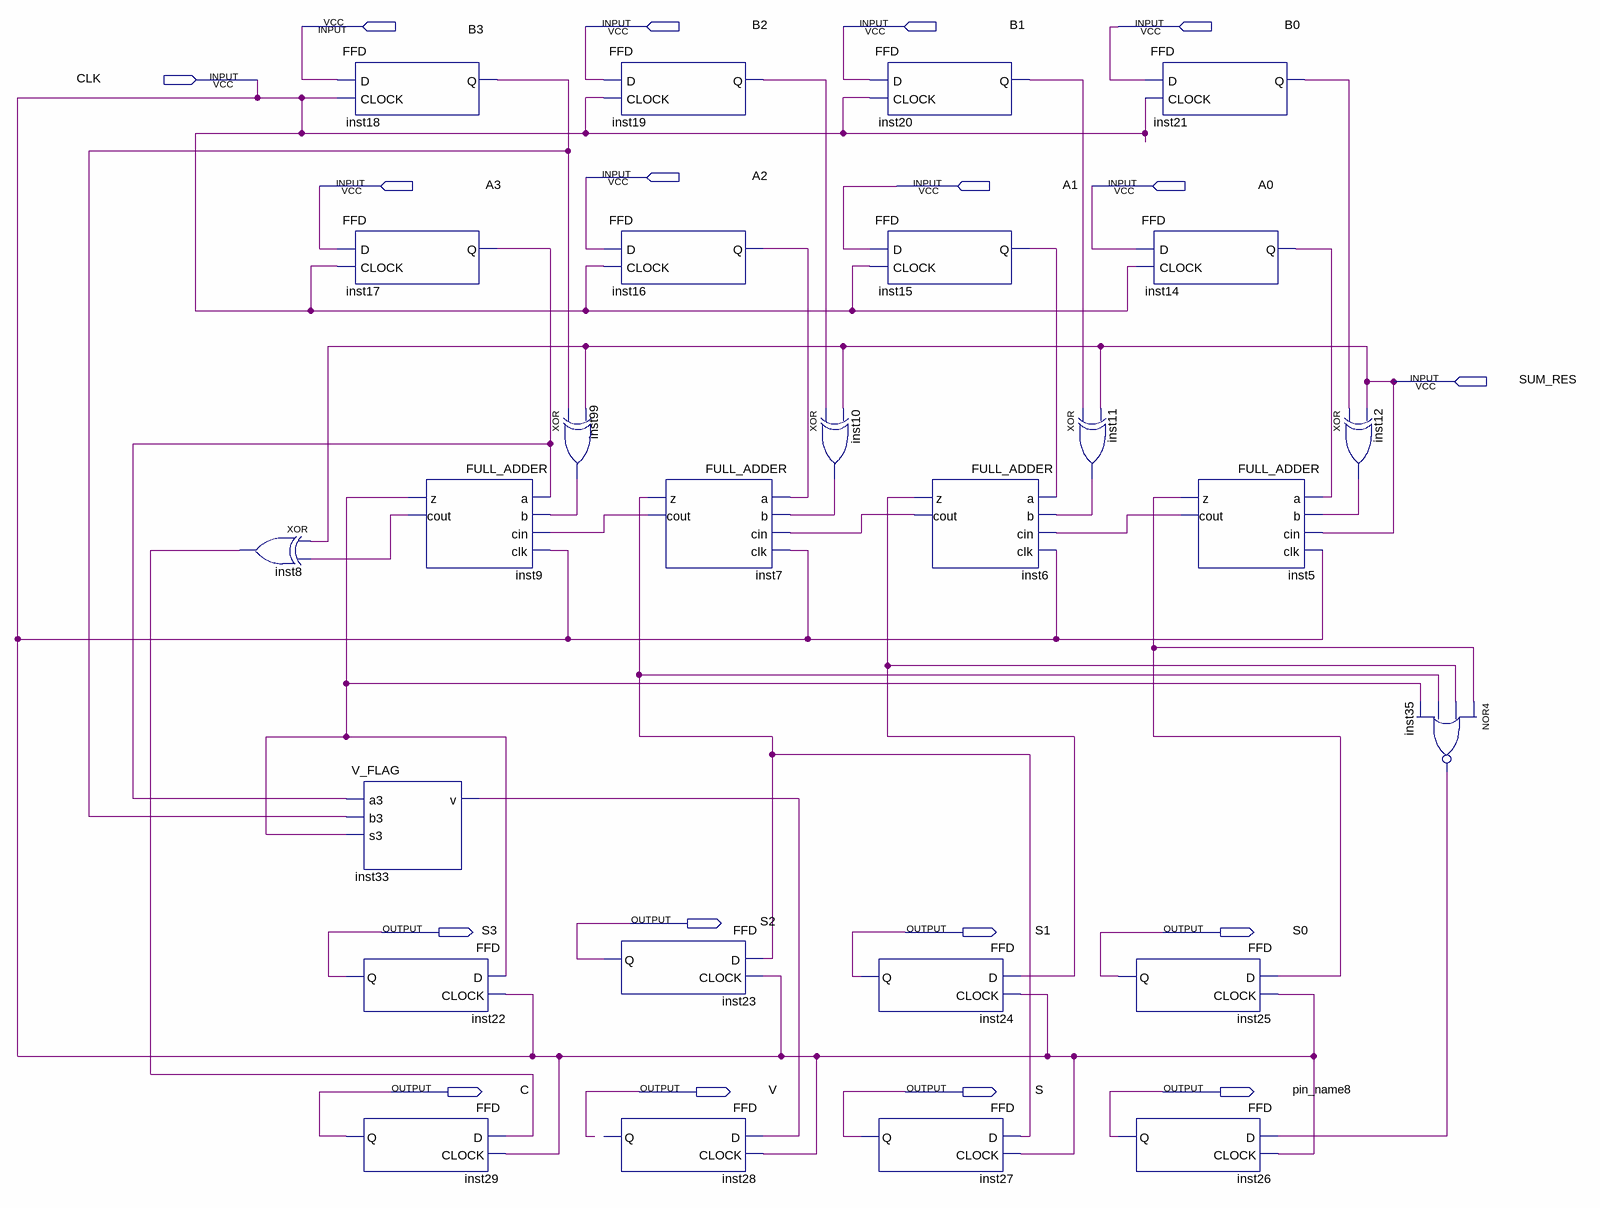
[diagram p0: schematic sheet]
// Quartus schematic PARTE_C.bdf as structural Verilog: 27 symbols, 18 pins
module PARTE_C (
  input  B3,
  input  B2,
  input  B1,
  input  B0,
  input  CLK,
  input  A2,
  input  A3,
  input  A1,
  input  A0,
  input  SUM_RES,
  output S2,
  output S3,
  output S1,
  output S0,
  output C,
  output V,
  output S,
  output pin_name8
);

  wire inst5_cout, inst5_z, inst6_cout, inst6_z, inst7_cout, inst7_z, inst8_out, inst9_cout, inst9_z,
       inst10_out, inst11_out, inst12_out, inst14_q, inst15_q, inst16_q, inst17_q, inst18_q, inst19_q,
       inst20_q, inst21_q, inst33_v, inst35_out, inst99_out;

  xor inst8 (inst8_out, SUM_RES, inst9_cout);
  FFD inst18 (.D(B3), .CLOCK(CLK), .Q(inst18_q));
  FFD inst17 (.D(A3), .CLOCK(CLK), .Q(inst17_q));
  V_FLAG inst33 (.a3(inst17_q), .b3(inst18_q), .s3(inst9_z), .v(inst33_v));
  FFD inst22 (.D(inst9_z), .CLOCK(CLK), .Q(S3));
  FFD inst29 (.D(inst8_out), .CLOCK(CLK), .Q(C));
  FULL_ADDER inst9 (.a(inst17_q), .b(inst99_out), .cin(inst7_cout), .clk(CLK), .z(inst9_z), .cout(inst9_cout));
  xor inst99 (inst99_out, inst18_q, SUM_RES);
  FFD inst19 (.D(B2), .CLOCK(CLK), .Q(inst19_q));
  FFD inst16 (.D(A2), .CLOCK(CLK), .Q(inst16_q));
  FFD inst23 (.D(inst7_z), .CLOCK(CLK), .Q(S2));
  FFD inst28 (.D(inst33_v), .CLOCK(CLK));  // open: Q
  FULL_ADDER inst7 (.a(inst16_q), .b(inst10_out), .cin(inst6_cout), .clk(CLK), .z(inst7_z), .cout(inst7_cout));
  xor inst10 (inst10_out, inst19_q, SUM_RES);
  FFD inst20 (.D(B1), .CLOCK(CLK), .Q(inst20_q));
  FFD inst15 (.D(A1), .CLOCK(CLK), .Q(inst15_q));
  FULL_ADDER inst6 (.a(inst15_q), .b(inst11_out), .cin(inst5_cout), .clk(CLK), .z(inst6_z), .cout(inst6_cout));
  FFD inst24 (.D(inst6_z), .CLOCK(CLK), .Q(S1));
  FFD inst27 (.D(inst7_z), .CLOCK(CLK), .Q(S));
  xor inst11 (inst11_out, inst20_q, SUM_RES);
  FFD inst25 (.D(inst5_z), .CLOCK(CLK), .Q(S0));
  FFD inst26 (.D(inst35_out), .CLOCK(CLK), .Q(pin_name8));
  FFD inst21 (.D(B0), .CLOCK(CLK), .Q(inst21_q));
  FFD inst14 (.D(A0), .CLOCK(CLK), .Q(inst14_q));
  FULL_ADDER inst5 (.a(inst14_q), .b(inst12_out), .cin(SUM_RES), .clk(CLK), .z(inst5_z), .cout(inst5_cout));
  xor inst12 (inst12_out, inst21_q, SUM_RES);
  nor inst35 (inst35_out, inst5_z, inst6_z, inst7_z, inst9_z);
endmodule
